# EAGLE schematic BlackBoard (EAGLE 9.3.0)
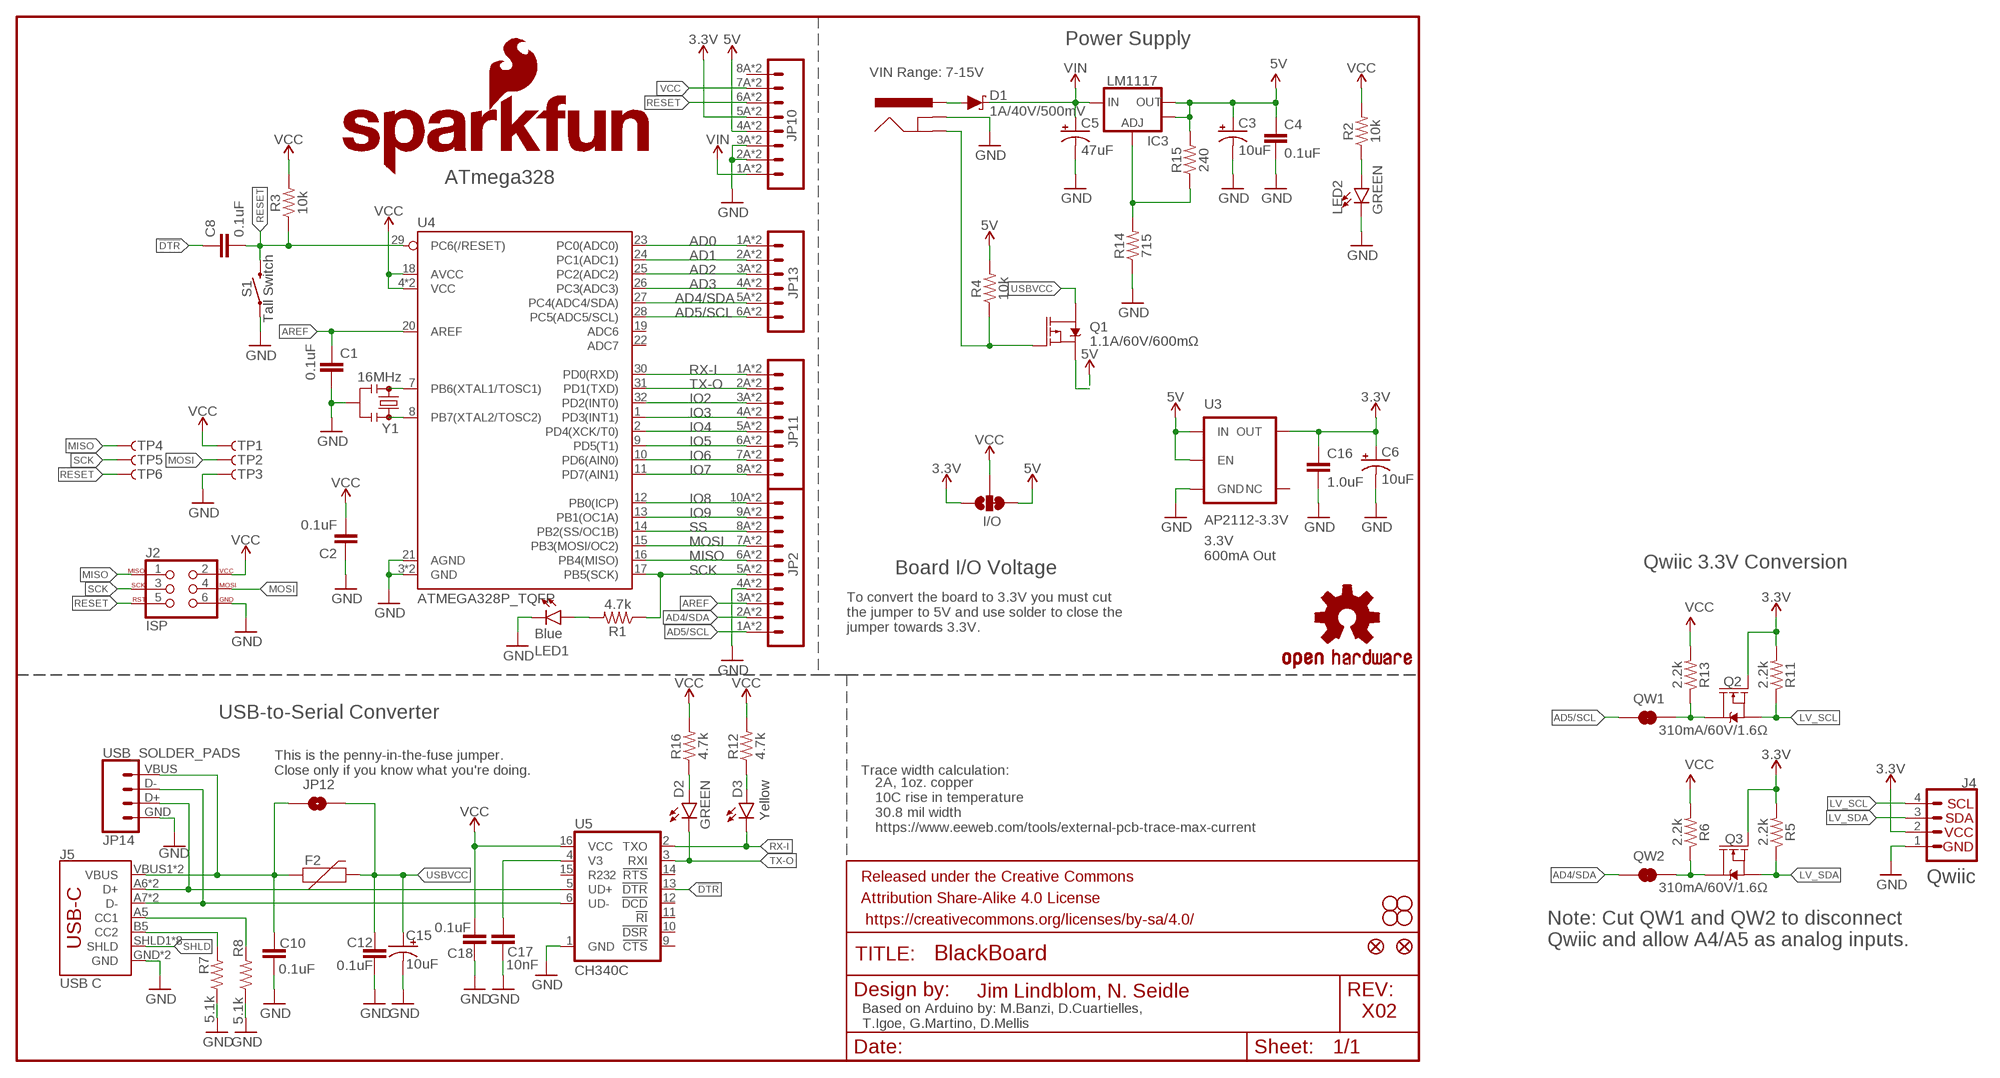
[diagram p0: schematic, sheet 1]

## Parts
C1  0.1uF  0.1UF-0603-25V-(+80/-20%)  [0603]
C2  0.1uF  0.1UF-0603-25V-(+80/-20%)  [0603]
C3  10uF  10UF-POLAR-EIA3216-16V-10%(TANT)  [EIA3216]
C4  0.1uF  0.1UF-0603-25V-(+80/-20%)  [0603]
C5  47uF  47UF-POLAR-PANASONIC_D-35V-20%  [PANASONIC_D]
C6  10uF  10UF-POLAR-EIA3216-16V-10%(TANT)  [EIA3216]
C8  0.1uF  0.1UF-0603-25V-(+80/-20%)  [0603]
C10  0.1uF  0.1UF-0603-25V-(+80/-20%)  [0603]
C12  0.1uF  0.1UF-0603-25V-(+80/-20%)  [0603]
C15  10uF  10UF-POLAR-EIA3216-16V-10%(TANT)  [EIA3216]
C16  1.0uF  1.0UF-0603-16V-10%  [0603]
C17  10nF  10NF-0603-50V-10%  [0603]
C18  0.1uF  0.1UF-0603-25V-(+80/-20%)  [0603]
D1  1A/40V/500mV  DIODE-SCHOTTKY-SS14  [SMA-DIODE]
D2  GREEN  LED-GREENLILYPAD  [LED-1206]
D3  Yellow  LED-YELLOW_HIDDENSILK  [LED-1206-HIDDENSILK]
F2  6V/2A  PPTC_6V2A  [1210]
FRAME1  FRAME-LETTER  [CREATIVE_COMMONS]
I/O  JUMPER-SMT_3_1-NC_TRACE_SILK  [SMT-JUMPER_3_1-NC_TRACE_SILK]
IC3  LM1117  V_REG_LM1117ALT1  [SOT223-ALT1]
J2  ISP  AVR_SPI_PROG_3X2SMD  [2X3_SMT_POSTS]
J3  POWER_JACKSUPER_BOMB_DIGITY  [POWER_JACK_SMD_OVERPASTE_SUPER_BOMB_DIGITY]
J4  QWIIC_CONNECTORJS-1MM  [JST04_1MM_RA]
J5  USB C  USB_C16PIN  [USB-C-16P]
JP1  SFE_LOGO_NAME.1_INCH  [SFE_LOGO_NAME_.1]
JP2  M10SMD_COMBO  [1X10_SMD_COMBINED]
JP3  STAND-OFF  [STAND-OFF]
JP4  STAND-OFF  [STAND-OFF]
JP5  STAND-OFF  [STAND-OFF]
JP6  STAND-OFF  [STAND-OFF]
JP7  SFE_LOGO_FLAME.1_INCH  [SFE_LOGO_FLAME_.1]
JP8  FIDUCIAL1X2  [FIDUCIAL-1X2]
JP9  FIDUCIAL1X2  [FIDUCIAL-1X2]
JP10  M08SMD-COMBO  [1X08_SMD_COMBINED]
JP11  JP11  M08SMD-COMBO  [1X08_SMD_COMBINED]
JP12  JUMPER-SMT_2_NO_SILK  [SMT-JUMPER_2_NO_SILK]
JP13  M06SMD-STRAIGHT-COMBO  [1X06_SMD_STRAIGHT_COMBO]
JP14  USB_SOLDER_PADS  [USB-SOLDER-PADS]
LED1  Blue  LED-BLUE_HIDDENSILK  [LED-1206-HIDDENSILK]
LED2  GREEN  LED-GREENLILYPAD  [LED-1206]
Q1  1.1A/60V/600mΩ  MOSFET_PCH-SI2309DS  [SOT23-3]
Q2  310mA/60V/1.6Ω  MOSFET-NCH-2N7002PW  [SOT323]
Q3  310mA/60V/1.6Ω  MOSFET-NCH-2N7002PW  [SOT323]
QW1  JUMPER-SMT_2_NC_TRACE_SILK  [SMT-JUMPER_2_NC_TRACE_SILK]
QW2  JUMPER-SMT_2_NC_TRACE_SILK  [SMT-JUMPER_2_NC_TRACE_SILK]
R1  4.7k  4.7KOHM-0603-1/10W-1%  [0603]
R2  10k  10KOHM-0603-1/10W-1%  [0603]
R3  10k  10KOHM-0603-1/10W-1%  [0603]
R4  10k  10KOHM-0603-1/10W-1%  [0603]
R5  2.2k  2.2KOHM-0603-1/10W-1%  [0603]
R6  2.2k  2.2KOHM-0603-1/10W-1%  [0603]
R7  5.1k  5.1KOHM5.1KOHM-0603-1/10W-1%  [0603]
R8  5.1k  5.1KOHM5.1KOHM-0603-1/10W-1%  [0603]
R11  2.2k  2.2KOHM-0603-1/10W-1%  [0603]
R12  4.7k  4.7KOHM-0603-1/10W-1%  [0603]
R13  2.2k  2.2KOHM-0603-1/10W-1%  [0603]
R14  715  715OHM-0603-1/10W-1%  [0603]
R15  240  240OHM-0603-1/10W-1%  [0603]
R16  4.7k  4.7KOHM-0603-1/10W-1%  [0603]
S1  Tall Switch  MOMENTARY-SWITCH-SPST-SMD-5.2-TALL-REDUNDANT  [TACTILE_SWITCH_SMD_5.2MM]
TP1  TP-3x5  TEST-POINT3X5  [PAD.03X.05]
TP2  TP-3x5  TEST-POINT3X5  [PAD.03X.05]
TP3  TP-3x5  TEST-POINT3X5  [PAD.03X.05]
TP4  TP-3x5  TEST-POINT3X5  [PAD.03X.05]
TP5  TP-3x5  TEST-POINT3X5  [PAD.03X.05]
TP6  TP-3x5  TEST-POINT3X5  [PAD.03X.05]
U3  AP2112-3.3V  V_REG_AP2112K-3.3V  [SOT23-5]
U4  ATMEGA328P_TQFP  [TQFP32-08]
U5  CH340C  [SO016]
U$16  OSHW-LOGOS  [OSHW-LOGO-S]
Y1  16MHz  RESONATOR-16MHZSMD_3.2X1.3  [RESONATOR-SMD-3.2X1.3]

## Nets
3.3V [power]: C6.+ C16.1 I/O.1 J4.2 JP10.5A JP10.5B Q2.1(G) Q3.1(G) R5.2 R11.2 U3.5(OUT)
5V [power]: C3.+ C4.1 I/O.3 IC3.2(OUT) IC3.4(OUT) JP10.4A JP10.4B Q1.2(S) R4.2 R15.2 U3.1(IN) U3.3(EN)
!DTR: C8.1 U5.13(!DTR)
AD0: JP13.1A JP13.1B U4.23(PC0(ADC0))
AD1: JP13.2A JP13.2B U4.24(PC1(ADC1))
AD2: JP13.3A JP13.3B U4.25(PC2(ADC2))
AD3: JP13.4A JP13.4B U4.26(PC3(ADC3))
AD4/SDA: JP2.2A JP2.2B JP13.5A JP13.5B QW2.1 U4.27(PC4(ADC4/SDA))
AD5/SCL: JP2.1A JP2.1B JP13.6A JP13.6B QW1.1 U4.28(PC5(ADC5/SCL))
AREF: C1.1 JP2.3A JP2.3B U4.20(AREF)
CC1: J5.A5(CC1) R8.2
CC2: J5.B5(CC2) R7.2
D+: J5.A6(D+) J5.B6(D+) JP14.D+ U5.5(UD+)
D-: J5.A7(D-) J5.B7(D-) JP14.D- U5.6(UD-)
GND: C1.2 C2.1 C3.- C4.2 C5.- C6.- C10.2 C12.2 C15.- C16.2 C17.2 C18.2 J2.6 J3.GND(GNDBREAK) J4.1 J5.GND J5.GND2(GND) JP2.4A JP2.4B JP10.2A JP10.2B JP10.3A JP10.3B JP14.GND LED1.C LED2.C R7.1 R8.1 R14.1 S1.1 S1.2 TP3.P$1 U3.2(GND) U4.3(GND) U4.5(GND) U4.21(AGND) U5.1(GND) Y1.2
INSERT: J3.P$4(GND) Q1.1(G) R4.1
IO2: JP11.3A JP11.3B U4.32(PD2(INT0))
IO3: JP11.4A JP11.4B U4.1(PD3(INT1))
IO4: JP11.5A JP11.5B U4.2(PD4(XCK/T0))
IO5: JP11.6A JP11.6B U4.9(PD5(T1))
IO6: JP11.7A JP11.7B U4.10(PD6(AIN0))
IO7: JP11.8A JP11.8B U4.11(PD7(AIN1))
IO8: JP2.10A JP2.10B U4.12(PB0(ICP))
IO9: JP2.9A JP2.9B U4.13(PB1(OC1A))
LV_SCL: J4.4 Q2.2(S) R11.1
LV_SDA: J4.3 Q3.2(S) R5.1
MISO: J2.1 JP2.6A JP2.6B TP4.P$1 U4.16(PB4(MISO))
MOSI: J2.4 JP2.7A JP2.7B TP2.P$1 U4.15(PB3(MOSI/OC2))
N$1: LED1.A R1.2
N$2: LED2.A R2.1
N$3: U4.7(PB6(XTAL1/TOSC1)) Y1.1
N$4: U4.8(PB7(XTAL2/TOSC2)) Y1.3
N$5: D2.A R16.1
N$6: C17.1 U5.4(V3)
N$7: Q2.3(D) QW1.2 R13.1
N$9: D3.A R12.1
N$15: IC3.1(ADJ) R14.2 R15.1
N$45: Q3.3(D) QW2.2 R6.1
PWRIN [power]: D1.A J3.VIN0(PWR)
RESET: C8.2 J2.5 JP10.6A JP10.6B R3.1 S1.3 S1.4 TP6.P$1 U4.29(PC6(/RESET))
RX-I: D3.C JP11.1A JP11.1B U4.30(PD0(RXD)) U5.2(TXO)
SCK: J2.3 JP2.5A JP2.5B R1.1 TP5.P$1 U4.17(PB5(SCK))
SHLD: J5.SHLD1(SHLD) J5.SHLD2(SHLD) J5.SHLD3(SHLD) J5.SHLD4(SHLD) J5.SHLD5(SHLD) J5.SHLD6(SHLD) J5.SHLD7(SHLD) J5.SHLD8(SHLD)
SS: JP2.8A JP2.8B U4.14(PB2(SS/OC1B))
TX-O: D2.C JP11.2A JP11.2B U4.31(PD1(TXD)) U5.3(RXI)
USBVCC [power]: C12.1 C15.+ F2.2 JP12.2 Q1.3(D)
VCC: C2.2 C18.1 I/O.2 J2.2 JP10.7A JP10.7B R2.2 R3.2 R6.2 R12.2 R13.2 R16.2 TP1.P$1 U4.4(VCC) U4.6(VCC) U4.18(AVCC) U5.16(VCC)
VIN [power]: C5.+ D1.C IC3.3(IN) JP10.1A JP10.1B
VUSB [power]: C10.1 F2.1 J5.VBUS1(VBUS) J5.VBUS2(VBUS) JP12.1 JP14.VBUS
Unconnected: JP10.8A JP10.8B U3.4(NC) U4.19(ADC6) U4.22(ADC7) U5.9(!CTS) U5.10(!DSR) U5.11(!RI) U5.12(!DCD) U5.14(!RTS) U5.15(R232)

## Notes on the sheet
- Power Supply
- VIN Range: 7-15V
- ATmega328
- 3.3V
  600mA Out
- Qwiic 3.3V Conversion
- Board I/O Voltage
- To convert the board to 3.3V you must cut
  the jumper to 5V and use solder to close the
  jumper towards 3.3V.
- USB-to-Serial Converter
- This is the penny-in-the-fuse jumper.
  Close only if you know what you're doing.
- Trace width calculation:
- 2A, 1oz. copper
  10C rise in temperature
  30.8 mil width
  https://www.eeweb.com/tools/external-pcb-trace-max-current
- Qwiic
- Note: Cut QW1 and QW2 to disconnect 
  Qwiic and allow A4/A5 as analog inputs.
- Jim Lindblom, N. Seidle
- X02
- Based on Arduino by: M.Banzi, D.Cuartielles, 
  T.Igoe, G.Martino, D.Mellis

## Library data of the parts
C1 C2 C4 C8 C10 C12 C18 = SparkFun-Capacitors:0.1UF: 0.1µF ceramic capacitors A capacitor is a passive two-terminal electrical component used to store electrical energy temporarily in an electric field.; PROD_ID: CAP-00810
C3 C6 C15 = SparkFun-Capacitors:10UF-POLAR: 10.0µF polarized capacitors A capacitor is a passive two-terminal electrical component used to store electrical energy temporarily in an electric field.; PROD_ID: CAP-00811
C5 = SparkFun-Capacitors:47UF-POLAR: 47µF polarized capacitors A capacitor is a passive two-terminal electrical component used to store electrical energy temporarily in an electric field.; PROD_ID: CAP-08478
C16 = SparkFun-Capacitors:1.0UF: 1µF ceramic capacitors A capacitor is a passive two-terminal electrical component used to store electrical energy temporarily in an electric field.; PROD_ID: CAP-00868
C17 = SparkFun-Capacitors:10NF: 0.01uF/10nF/10,000pF ceramic capacitors A capacitor is a passive two-terminal electrical component used to store electrical energy temporarily in an electric field. CAP-09321; PROD_ID: CAP-00867
D1 = SparkFun-DiscreteSemi:DIODE-SCHOTTKY: Schottky diode A Schottky diode is a semiconductor diode which has a low forward voltage drop and a very fast switching action.; PROD_ID: DIO-08053
D2 LED2 = SparkFun-LED:LED-GREEN: Green SMD LED Used in manufacturing of various products at SparkFun Packages: 0603 - SMD 0603 package [Product Link] <http://www.futureelectronics.com/en/technologies/semiconductors/optoelectronics/leds/Pages/9894312-LTST-C190GKT.aspx?CrossPart=HSMG-C190&IM=0> LilyPad 1206 - SMD1206 LilyPad package [Product Link] <http://www.futureelectronics.com/en/Technologies/Product.aspx?ProductID=IN150NGHARVATEKCORPORATION2049943&IM=0> 1206 - SMD1206 package [Product Link] <http://www.futureelectronics.com/en/technologies/semiconductors/optoelectronics/leds/Pages/8315665-LTST-C150KGKT.aspx?IM=0> 1206 Bottom Mount -SMD 1206 Bottom Mount [Product Link] <http://www.digikey.com/product-detail/en/lite-on-inc/LTST-C230KGKT/160-1456-1-ND/386854> SparkFun Products: Pro Mini 328 -5V <https://www.sparkfun.com/products/821> RedBoard <https://www.sparkfun.com/products/12757> MP3 Trigger <https://www.sparkfun.com/products/13720> Makey Makey <https://www.sparkfun.com/products/11076>; PROD_ID: DIO-09910
D3 = SparkFun-LED:LED-YELLOW: Yellow SMD LED Used in manufacturing several products at SparkFun. Packages: 0603 - SMD 0603 package[Product Link] <http://www.kingbrightusa.com/product.asp?catalog_name=LED&product_id=APT1608SYCK> 0603 -SMART - SMART SMD 0603 package (more efficient/more expensive) [Product Link] <http://www.osram-os.com/osram_os/en/products/product-catalog/led-light-emitting-diodes/smartled-0603/ly-l29k/index.jsp> LilyPad - SMD1206 package[Product Datasheet] <https://www.sparkfun.com/datasheets/DevTools/LilyPad/Q150YUS4.pdf> SparkFun Products: Blynk Board <https://www.sparkfun.com/products/13794> IOIO-OTG <https://www.sparkfun.com/products/13613> XBee Explorer Serial <https://www.sparkfun.com/products/13225>; PROD_ID: DIO-09909
F2 = SparkFun-Fuses:PPTC: Resettable Fuse PPTC Resettable Fuse. Really a sort of resistor with a polymeric positive temperature coefficient whose resistance increases dramatically with an increase in temperature. When heated by the power passing through the resistance rises causing the current to be limited, protecting the circuit. This is achieved by the transition of the polymer from a crystalline to an amorphous state where the conductive carbon separates breaking the conductive pathways found in the cool crystalline structure. When a PPTC cools back down it resumes conducting letting the circuit turn back on. SparkFun Products: SparkFun RedBoard - Programmed with Arduino <https://www.sparkfun.com/products/12757> Pro Micro - 5V/16MHz <https://www.sparkfun.com/products/12640> Arduino Pro 328 - 5V/16MHz <https://www.sparkfun.com/products/10915> MP3 Trigger <https://www.sparkfun.com/products/13720>; PROD_ID: RES-13714
FRAME1 = SparkFun-Aesthetics:FRAME-LETTER: Schematic Frame - Letter Standard 8.5x11 US Letter frame
I/O = SparkFun-Jumpers:JUMPER-SMT_3_1-NC_TRACE: Normally closed trace jumper (1 of 2 connections) This jumper has a trace between two pads so it's normally closed (NC). The other connection is normally open (NO). Use a razor knife to open the connection. For best results follow the IPC guidelines for cutting traces: Cutout at least 0.063 mm (0.005 in). Remove all loose material to clean up the cut area. Seal the cut with an approved epoxy. Reapply solder to reclose the connection, or to close the NO connection.
IC3 = Testing:V_REG_LM1117: Voltage Regulator LM1117 Standard adjustable voltage regulator but in SMD form. Spark Fun Electronics SKU : COM-00595; PROD_ID: VREG-08170
J2 = SparkFun-Connectors:AVR_SPI_PROG_3X2: AVR ISP 6 Pin This is the reduced ISP connector for AVR programming. Common on Arduino. This footprint will take up less PCB space and can be used with a 10-pin to 6-pin adapter such as SKU: BOB-08508 **Special note about "TEST_POINT" package. The stop mask is on the top side, so if you want your programming test points to be on the bottom of your board, make sure to place this package on the bottom side of the board. This also ensure that the orientation to program from the bottom side will be correct. SparkFun Products: SparkFun ISP Pogo Adapter <https://www.sparkfun.com/products/11591> - NS Tiny AVR Programmer <https://www.sparkfun.com/products/11801> -PTH
J3 = Testing:POWER_JACK: Power Jack This is the standard 5.5mm barrel jack for power. The PTH is the most common, proven, reliable, footprint. All others are experimental. The Slot footprint only works if the mill layer is transmitted to the PCB fab house so be warned. Spark Fun Electronics SKU : PRT-00119. Mating wall wart : TOL-00298 (and others); PROD_ID: CONN-08106
J4 = SparkFun-Connectors:QWIIC_CONNECTOR: SparkFun I2C Standard Qwiic Connector An SMD 1mm pitch JST connector makes it easy and quick (get it? Qwiic?) to connect I2C devices to each other. The Qwiic system <http://www.sparkfun.com/qwiic> enables fast and solderless connection between popular platforms and various sensors and actuators. We carry 200mm <https://www.sparkfun.com/products/14204>, 100mm <https://www.sparkfun.com/products/14205>, 50mm <https://www.sparkfun.com/products/14206>, and breadboard friendly <https://www.sparkfun.com/products/14207> Qwiic cables. We also offer 10 pcs strips <https://www.sparkfun.com/products/14323> the SMD connectors.; PROD_ID: CONN-13694
J5 = USB-C:USB_C: USB Type C 16Pin Connector
JP1 = SparkFun-Aesthetics:SFE_LOGO_NAME: SparkFun Font Logo This is the SparkFun name logo. The logo on the schematic will always be the same size; the package variant is the height of the flame part of the logo (or the height the flame would be, if it were drawn). Default layer for the logo on the board is tSilk.
JP2 = SparkFun-Connectors:M10: Header 10 Standard 10-pin 0.1" header. Use with straight break away headers (SKU : PRT-00116), right angle break away headers (PRT-00553), swiss pins (PRT-00743), machine pins (PRT-00117), and female headers (PRT-00115).; PROD_ID: CONN-11219
JP3-JP6 = SparkFun:STAND-OFF: Stand Off This is the mechanical footprint for a #4 phillips button head screw. Use the keepout ring to avoid running the screw head into surrounding components. SKU : PRT-00447
JP7 = SparkFun-Aesthetics:SFE_LOGO_FLAME: SparkFun Flame Logo This is the SparkFun flame logo. The logo on the schematic will always be the same size; the package variant is the height of the flame. Default layer for the logo on the board is tSilk.
JP8 JP9 = SparkFun:FIDUCIAL: Fiducial Alignment Points Various fiducial points for machine vision alignment.
JP10 JP11 = SparkFun-Connectors:M08: Header 8 Standard 8-pin 0.1" header. Use with straight break away headers (SKU : PRT-00116), right angle break away headers (PRT-00553), swiss pins (PRT-00743), machine pins (PRT-00117), and female headers (PRT-00115).; PROD_ID: CONN-10204
JP12 = SparkFun-Jumpers:JUMPER-SMT_2_NO: Normally open jumper This jumper has two pads in close proximity to each other. Apply solder to close the connection. Round pads are easier to solder for beginners, but are a lot larger. SparkFun Product that uses the round pads: SparkFun EL Sequencer <https://www.sparkfun.com/products/12781>
JP13 = SparkFun-Connectors:M06: Header 6 Standard 6-pin 0.1" header. Use with straight break away headers (SKU : PRT-00116), right angle break away headers (PRT-00553), swiss pins (PRT-00743), machine pins (PRT-00117), and female headers (PRT-00115). Molex polarized connector foot print use with SKU : PRT-08094 with associated crimp pins and housings. NOTES ON THE VARIANTS LOCK and LOCK_LONGPADS... This footprint was designed to help hold the alignment of a through-hole component (i.e. 6-pin header) while soldering it into place. You may notice that each hole has been shifted either up or down by 0.005 of an inch from it's more standard position (which is a perfectly straight line). This slight alteration caused the pins (the squares in the middle) to touch the edges of the holes. Because they are alternating, it causes a "brace" to hold the component in place. 0.005 has proven to be the perfect amount of "off-center" position when using our standard breakaway headers. Although looks a little odd when you look at the bare footprint, once you have a header in there, the alteration is very hard to notice. Also,if you push a header all the way into place, it is covered up entirely on the bottom side. This idea of altering the position of holes to aid alignment will be further integrated into the Sparkfun Library for other footprints. It can help hold any component with 3 or more connection pins.; PROD_ID: CONN-10203
JP14 = SparkFun-Connectors:USB_SOLDER_PADS: Solder pad access to USB pins. Helpful to expose on PCBs so user can attach external USB connector if necessary.
LED1 = SparkFun-LED:LED-BLUE: Blue SMD LED Used in manufacturing of various products at SparkFun Packages: 0603 - SMD 0603 package [Product Link] <http://www.digikey.com/product-detail/en/SMLE12BC7TT86/511-1589-2-ND/1641808> 1206 - SMD1206 package [Product Link] <http://www.digikey.com/product-detail/en/lite-on-inc/LTST-C150TBKT/160-1643-1-ND/573584> SparkFun Products: ESP8266 Thing-Dev Board <https://www.sparkfun.com/products/13711> RedBoard <https://www.sparkfun.com/products/12757>; PROD_ID: DIO-09911
Q1 = SparkFun-DiscreteSemi:MOSFET_PCH: P-channel MOSFETs Voltage controlled devices that allow control of high current outputs. SparkFun Products: SparkFun ESP32 Thing <https://www.sparkfun.com/products/13907> SparkFun ESP8266 Thing <https://www.sparkfun.com/products/13231>; PROD_ID: TRANS-08285
Q2 Q3 = SparkFun-DiscreteSemi:MOSFET-NCH: N-channel MOSFETs Voltage controlled devices that allow control of high current outputs. SparkFun Products: SparkFun OpenScale <https://www.sparkfun.com/products/13261> SparkFun Digital Sandbox <https://www.sparkfun.com/products/12651> SparkFun Monster Moto Shield <https://www.sparkfun.com/products/10182> SparkFun MOSFET Power Controller <https://www.sparkfun.com/products/11214>; PROD_ID: TRANS-11151
QW1 QW2 = SparkFun-Jumpers:JUMPER-SMT_2_NC_TRACE: Normally closed trace jumper This jumper has a trace between two pads so it's normally closed (NC). Use a razor knife to open the connection. For best results follow the IPC guidelines for cutting traces: Cutout at least 0.063 mm (0.005 in). Remove all loose material to clean up the cut area. Seal the cut with an approved epoxy. Reapply solder to reclose the connection.
R1 R12 R16 = SparkFun-Resistors:4.7KOHM: 4.7kΩ resistor A resistor is a passive two-terminal electrical component that implements electrical resistance as a circuit element. Resistors act to reduce current flow, and, at the same time, act to lower voltage levels within circuits. - Wikipedia; PROD_ID: RES-07857
R2-R4 = SparkFun-Resistors:10KOHM: 10kΩ resistor A resistor is a passive two-terminal electrical component that implements electrical resistance as a circuit element. Resistors act to reduce current flow, and, at the same time, act to lower voltage levels within circuits. - Wikipedia; PROD_ID: RES-00824
R5 R6 R11 R13 = SparkFun-Resistors:2.2KOHM: 2.2kΩ resistor A resistor is a passive two-terminal electrical component that implements electrical resistance as a circuit element. Resistors act to reduce current flow, and, at the same time, act to lower voltage levels within circuits. - Wikipedia; PROD_ID: RES-08272
R7 R8 = SparkFun-Resistors:5.1KOHM; PROD_ID: RES-12083
R14 = SparkFun-Resistors:715OHM: 715Ω resistor A resistor is a passive two-terminal electrical component that implements electrical resistance as a circuit element. Resistors act to reduce current flow, and, at the same time, act to lower voltage levels within circuits. - Wikipedia; PROD_ID: RES-07850
R15 = SparkFun-Resistors:240OHM: 240Ω resistor A resistor is a passive two-terminal electrical component that implements electrical resistance as a circuit element. Resistors act to reduce current flow, and, at the same time, act to lower voltage levels within circuits. - Wikipedia; PROD_ID: RES-07849
S1 = SparkFun-Switches:MOMENTARY-SWITCH-SPST: Momentary Switch (Pushbutton) - SPST Normally-open (NO) SPST momentary switches (buttons, pushbuttons). Variants PTH-12MM - 12mm square, through-hole Momentary Pushbutton Switch - 12mm Square <https://www.sparkfun.com/products/9190> (COM-09190) PTH-6.0MM, PTH-6.0MM-KIT - 6.0mm square, through-hole Mini Pushbutton Switch <https://www.sparkfun.com/products/97> (COM-00097) KIT package intended for soldering kit's - only one side of pads' copper is exposed. PTH-RIGHT-ANGLE-KIT - Right-angle, through-hole Right Angle Tactile Button <https://www.sparkfun.com/products/10791> - Used on SparkFun BigTime Watch Kit <https://www.sparkfun.com/products/11734> SMD-12MM - 12mm square, surface-mount Tactile Button - SMD (12mm) <https://www.sparkfun.com/products/12993> (COM-12993) Used on SparkFun PicoBoard <https://www.sparkfun.com/products/11888> SMD-4.5MM - 4.5mm Square Trackball Switch Used on SparkFun Blackberry Trackballer Breakout <https://www.sparkfun.com/products/13169> SMD-4.6MMX2.8MM - 4.60mm x 2.80mm, surface mount Used on SparkFun SAMD21 Mini Breakout <https://www.sparkfun.com/products/13664> SMD-5.2MM, SMD-5.2-REDUNDANT - 5.2mm square, surface-mount Mini Pushbutton Switch - SMD <https://www.sparkfun.com/products/8720> (COM-08720) Used on Arduino Pro Mini <https://www.sparkfun.com/products/11114> REDUNDANT package connects both switch circuits together SMD-6.0X3.5MM - 6.0 x 3.5mm, surface mount Momentary Reset Switch SMD <https://www.sparkfun.com/products/8229> (COM-08229) SMD-6.2MM-TALL - 6.2mm square, surface mount Tactile Button - SMD (6mm) <https://www.sparkfun.com/products/12992> Used on SparkFun Digital Sandbox <https://www.sparkfun.com/products/12651> SMD-RIGHT-ANGLE - Right-angle, surface mount Used on SparkFun Block for Intel® Edison - Arduino <https://www.sparkfun.com/products/13036>; PROD_ID: SWCH-14139
TP1-TP4 TP6 = SparkFun-Connectors:TEST-POINT: SparkFun Test Points Bare copper test points for troubleshooting or In-Circuit-Testing. These are used by our Production team for verifying production board runs using pogo-pins on test beds. SparkFun Products: SparkFun LSM9DS1 Breakout <https://www.sparkfun.com/products/13284> SparkFun PSOC <https://www.sparkfun.com/products/13714> SparkFun Load Cell Amplifier <https://www.sparkfun.com/products/13879>
TP5 = SparkFun-Passives:TEST-POINT: Bare copper test points for troubleshooting or ICT
U3 = SparkFun-PowerIC:V_REG_AP2112: AP2112 - 600mA CMOS LDO Regulator w/ Enable The AP2112 is CMOS process low dropout linear regulator with enable function, the regulator delivers a guaranteed 600mA (min.) continuous load current. Features Output Voltage Accuracy: ±1.5% Output Current: 600mA (Min.) Foldback Short Current Protection: 50mA Enable Function to Turn ON/OFF VOUT Low Dropout Voltage (3.3V): 250mV (Typ.) @IOUT=600mA Excellent Load Regulation: 0.2%/A (Typ.) Excellent Line Regulation: 0.02%/V (Typ.) Low Quiescent Current: 55μA (Typ.) Low Standby Current: 0.01μA (Typ.) Low Output Noise: 50μVRMS PSRR: 100Hz -65dB, 1kHz -65dB OTSD Protection Stable with 1.0μF Flexible Cap: Ceramic, Tantalum and Aluminum Electrolytic Operation Temperature Range: -40°C to 85°C ESD: MM 400V, HBM 4000V; PROD_ID: VREG-12457; VALUE: 3.3V
U4 = SparkFun-IC-Microcontroller:ATMEGA328P_TQFP: Popular 328P in QFP Storefront component: ATmega328 - TQFP <https://www.sparkfun.com/products/13448> (COM-13448) Datasheet <http://www.sparkfun.com/datasheets/Components/SMD/ATMega328.pdf> SparkFun Products SparkFun RedBoard - Programmed with Arduino <https://www.sparkfun.com/products/12757> (DEV-12757) Arduino Pro Mini 328 - 5V/16MHz <https://www.sparkfun.com/products/11113> (DEV-11113) Arduino Pro Mini 328 - 3.3V/8MHz <https://www.sparkfun.com/products/11114> (DEV-11114) SparkFun OpenLog <https://www.sparkfun.com/products/13712> (DEV-13712) SparkFun MicroView - OLED Arduino Module <https://www.sparkfun.com/products/12923> (DEV-12923) SparkFun Digital Sandbox <https://www.sparkfun.com/products/12651> (DEV-12651) SparkFun PicoBoard <https://www.sparkfun.com/products/11888> (WIG-11888) Arduino Fio <https://www.sparkfun.com/products/10116> (DEV-10116) LilyPad Arduino 328 Main Board <https://www.sparkfun.com/products/13342> (DEV-13342) SparkFun RedStick <https://www.sparkfun.com/products/13741> (DEV-13741) LilyPad MP3 <https://www.sparkfun.com/products/11013> (DEV-11013) LilyPad Arduino SimpleSnap <https://www.sparkfun.com/products/10941> (DEV-10941) SparkFun Stepoko <https://www.sparkfun.com/products/13899> (ROB-13899) SparkFun Geiger Counter <https://www.sparkfun.com/products/11345> (SEN-11345) SparkFun EL Sequencer <https://www.sparkfun.com/products/12781> (COM-12781) Arduino Pro 328 - 5V/16MHz <https://www.sparkfun.com/products/10915> (DEV-10915) CryptoCape <https://www.sparkfun.com/products/12773> (DEV-12773) SparkFun IR Thermometer Evaluation Board - MLX90614 <https://www.sparkfun.com/products/10740> (SEN-10740) SparkFun RedBot Mainboard <https://www.sparkfun.com/products/12097> (ROB-12097) Arduino Pro 328 - 3.3V/8MHz <https://www.sparkfun.com/products/10914> (DEV-10914) SparkFun Block for Intel® Edison - Arduino <https://www.sparkfun.com/products/13036> (DEV-13036) SparkFun Simon Says - Surface Mount Soldering Kit <https://www.sparkfun.com/products/10935> (KIT-10935) SparkFun 7-Segment Serial Display - Red <https://www.sparkfun.com/products/11441> (COM-11441) SparkFun 7-Segment Serial Display - White <https://www.sparkfun.com/products/11629> (COM-11629) SparkFun 7-Segment Serial Display - Yellow <https://www.sparkfun.com/products/11443> (COM-11443) SparkFun 7-Segment Serial Display - Kelly Green <https://www.sparkfun.com/products/11440> (COM-11440) SparkFun 7-Segment Serial Display - Blue <https://www.sparkfun.com/products/11442> (COM-11442) SparkFun OpenSegment Serial Display - 20mm (Blue) <https://www.sparkfun.com/products/11647> (COM-11647) SparkFun OpenSegment Serial Display - 20mm (Green) <https://www.sparkfun.com/products/11646> (COM-11646) SparkFun OpenSegment Serial Display - 20mm (White) <https://www.sparkfun.com/products/11648> (COM-11648) SparkFun OpenSegment Serial Display - 20mm (Red) <https://www.sparkfun.com/products/11644> (COM-11644) SparkFun OpenSegment Serial Display - 20mm (Yellow) <https://www.sparkfun.com/products/11645> (COM-11645) SparkFun OpenSegment Shield <https://www.sparkfun.com/products/13190> (DEV-13190); PROD_ID: IC-09069
U5 = SparkFun-IC-Comms:CH340C; PROD_ID: IC-14038
U$16 = SparkFun-Aesthetics:OSHW-LOGO: Open-Source Hardware (OSHW) Logo This logo indicates the piece of hardware it is found on incorporates a OSHW license and/or adheres to the definition of open source hardware found here: http://freedomdefined.org/OSHW
Y1 = SparkFun-Clocks:RESONATOR-16MHZ: 16MHz Resonator Digikey Example <http://www.digikey.com/product-detail/en/murata-electronics-north-america/CSTCE16M0V53-R0/490-1198-1-ND/584635> Frequency: 16MHz Frequency Stability: ±0.3% Frequency Tolerance: ±0.5% Capacitance: 15pF SparkFun Products SparkFun OpenLog <https://www.sparkfun.com/products/13712> SparkFun MicroView - OLED Arduino Module <https://www.sparkfun.com/products/12923>; PROD_ID: XTAL-08900

## Net classes
1 power: width 0.762 mm